# Altium schematic sheet Sheet1.SchDoc
size A4
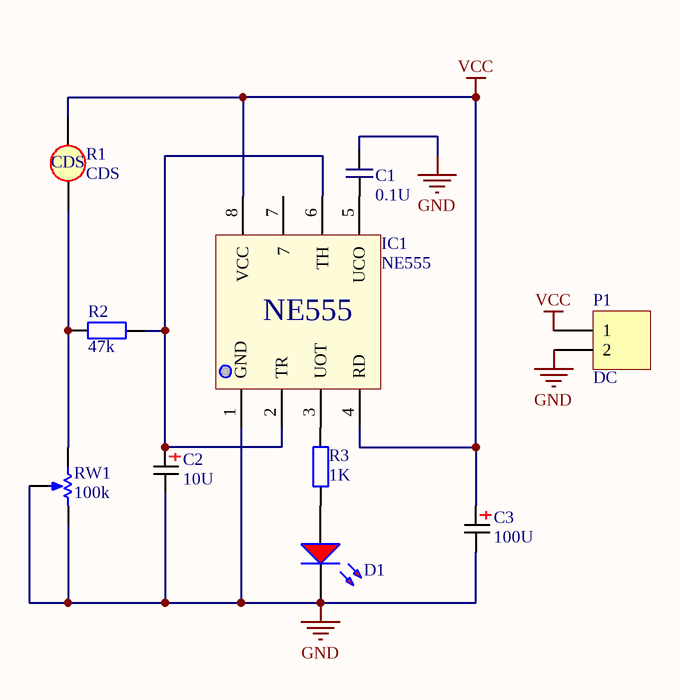
[diagram p0: Sheet1.SchDoc]

## Parts
C1  0.1U  [RAD0.1]
C2  10U  [CF0.1]
C3  100U  [CF0.1]
D1  LED0  [LED]  (value not drawn)
IC1  NE555  [DIP-8]
P1  DC  [HDR1X2]
R1  CDS  [CDS]
R2  47k  [AXIAL-0.3]
R3  1K  [AXIAL-0.3]
RW1  100k  [RW1]

## Nets
GND: C1.2 C2.2 C3.2 D1.2(K) IC1.1(GND) P1.2 RW1.2(TAP) RW1.3(BOT)
VCC: C3.1 IC1.4(RD) IC1.8(VCC) P1.1 R1.1
NetC1_1: C1.1 IC1.5(UCO)
NetC2_1: C2.1 IC1.2(TR) IC1.6(TH) R2.2
NetD1_1: D1.1(A) R3.1
NetIC1_3: IC1.3(UOT) R3.2
NetR1_2: R1.2 R2.1 RW1.1(TOP)

Not connected (* = marked no-connect by the designer): IC1 7

## Library data of the parts
C1 = Cap
C2 C3 = Cap Pol
P1 = Header 2: Header, 2-Pin; LatestRevisionDate: 17-Jul-2002; LatestRevisionNote: Re-released for DXP Platform.; Publisher: Altium Limited
R2 = Res: Resistor; Value: 1K; Published: 8-Jun-2000; LatestRevisionDate: 17-Jul-2002; LatestRevisionNote: Re-released for DXP Platform.; PackageReference: AXIAL-0.4; Publisher: Altium Limited
R3 = Res: Resistor; Published: 8-Jun-2000; LatestRevisionDate: 17-Jul-2002; LatestRevisionNote: Re-released for DXP Platform.; PackageReference: AXIAL-0.4; Publisher: Altium Limited; Value: 1K
RW1 = RW1
D1 = LED0: Published: 8-Jun-2000; LatestRevisionDate: 08-Jul-2005; LatestRevisionNote: Mech Layer 1 removed.; PackageReference: LED-0; Publisher: Altium Limited